# Altium project CamperPi.PrjPcb
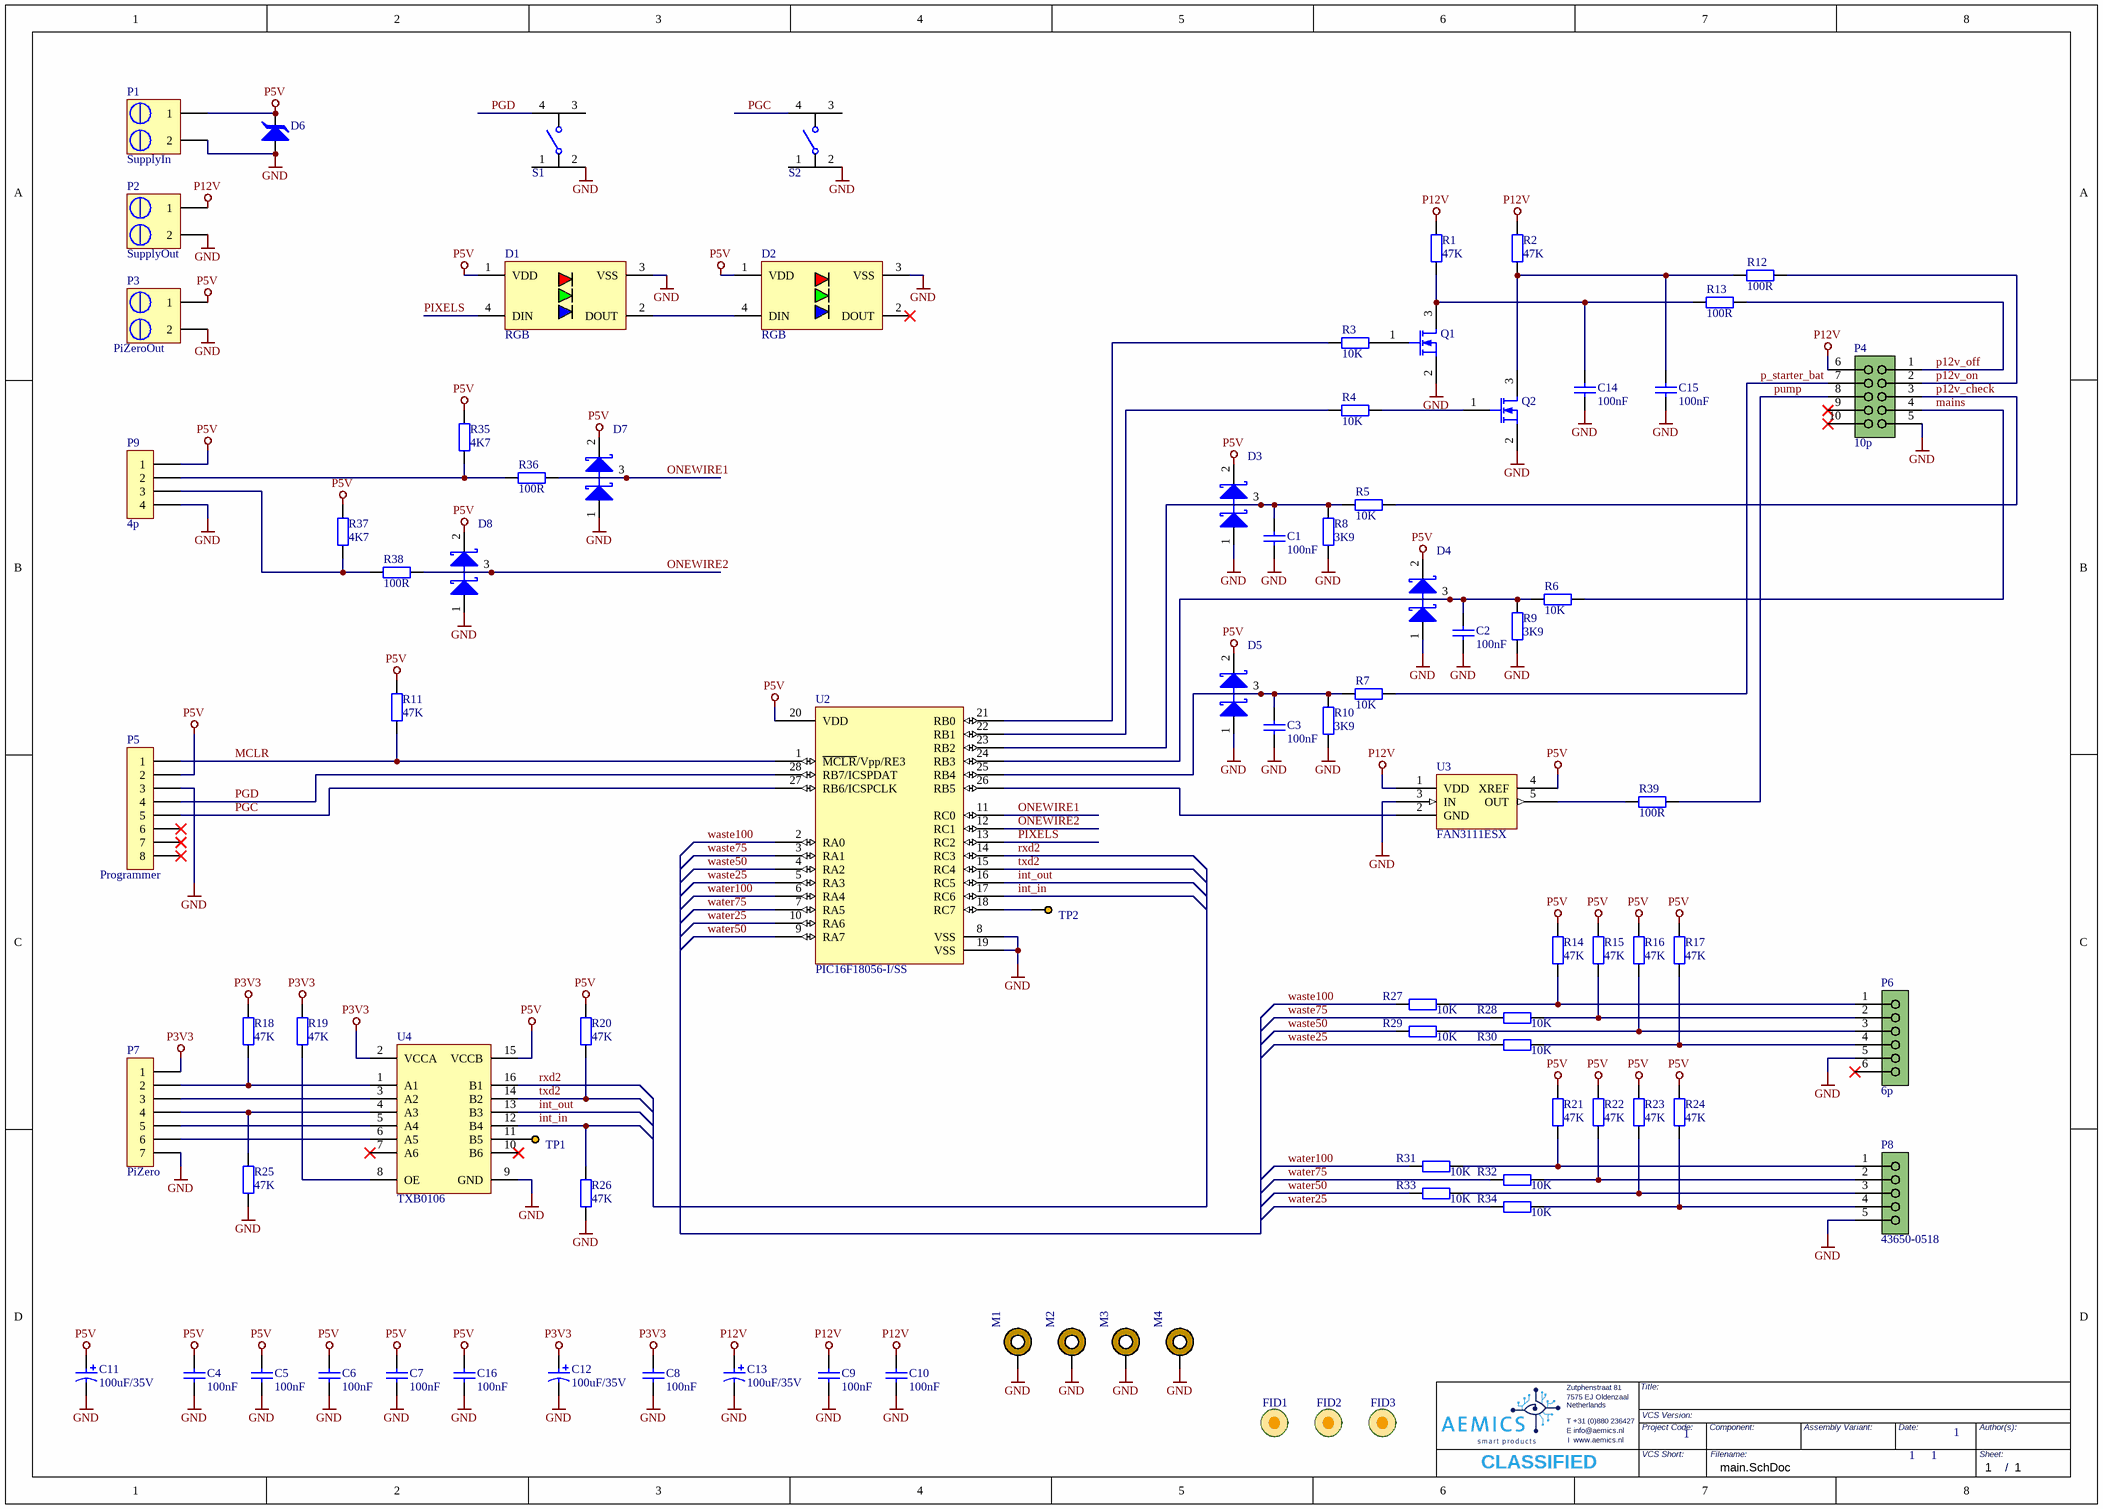
[diagram p0: main.SchDoc]
1 sheet, 88 parts. Net scope: global (net labels, ports and power ports of the same name join across sheets).
Board file: main.PcbDoc

## Sheet main.SchDoc: ?
size A3; ENG_APP_DATE: --/--/--; DSN_APP_DATE: --/--/--; CHK_APP_DATE: --/--/--; DrawnBy: ??; Organization: AEMICS; Address1: Zutphenstraat 81; Address2: 7575 EJ Oldenzaal; Address3: Netherlands; Address4: T +31 (0)880 236427; SheetNumber: 1; SheetTotal: 1; Clasification: CLASSIFIED; Project: ?????; Address6: E info@aemics.nl; Address7: I  www.aemics.nl

### Parts
C1  value 100nF  [C0603]  (hidden comment: Capacitor Ceramic)
C2  value 100nF  [C0603]  (hidden comment: Capacitor Ceramic)
C3  value 100nF  [C0603]  (hidden comment: Capacitor Ceramic)
C4  value 100nF  [C0603]  (hidden comment: Capacitor Ceramic)
C5  value 100nF  [C0603]  (hidden comment: Capacitor Ceramic)
C6  value 100nF  [C0603]  (hidden comment: Capacitor Ceramic)
C7  value 100nF  [C0603]  (hidden comment: Capacitor Ceramic)
C8  value 100nF  [C0603]  (hidden comment: Capacitor Ceramic)
C9  value 100nF  [C0603]  (hidden comment: Capacitor Ceramic)
C10  value 100nF  [C0603]  (hidden comment: Capacitor Ceramic)
C11  value 100uF/35V  [ELCO D-PACK]  (hidden comment: Capacitor Electrolytic)
C12  value 100uF/35V  [ELCO D-PACK]  (hidden comment: Capacitor Electrolytic)
C13  value 100uF/35V  [ELCO D-PACK]  (hidden comment: Capacitor Electrolytic)
C14  value 100nF  [C0603]  (hidden comment: Capacitor Ceramic)
C15  value 100nF  [C0603]  (hidden comment: Capacitor Ceramic)
C16  value 100nF  [C0603]  (hidden comment: Capacitor Ceramic)
D1  value RGB  [WS2812B-B]  (hidden comment: WS2812B-B)
D2  value RGB  [WS2812B-B]  (hidden comment: WS2812B-B)
D3  DIODE SCHOTTKY DUAL A1K2AK3  [SOT23-3]  (value not drawn)
D4  DIODE SCHOTTKY DUAL A1K2AK3  [SOT23-3]  (value not drawn)
D5  DIODE SCHOTTKY DUAL A1K2AK3  [SOT23-3]  (value not drawn)
D6  DIODE TVS UNIDIR A1K2  [SOD-323]  (value not drawn)
D7  DIODE SCHOTTKY DUAL A1K2AK3  [SOT23-3]  (value not drawn)
D8  DIODE SCHOTTKY DUAL A1K2AK3  [SOT23-3]  (value not drawn)
FID1  Fiducial  [FIDUCIAL1MM]  (value not drawn)
FID2  Fiducial  [FIDUCIAL1MM]  (value not drawn)
FID3  Fiducial  [FIDUCIAL1MM]  (value not drawn)
M1  PTH  [PTH-M2.5-D4.0]  (value not drawn)
M2  PTH  [PTH-M2.5-D4.0]  (value not drawn)
M3  PTH  [PTH-M2.5-D4.0]  (value not drawn)
M4  PTH  [PTH-M2.5-D4.0]  (value not drawn)
P1  value SupplyIn  [TERMBLOCK508P-SCREW-2]  (hidden comment: ScrewTerminal 2p)
P2  value SupplyOut  [TERMBLOCK508P-SCREW-2]  (hidden comment: ScrewTerminal 2p)
P3  value PiZeroOut  [TERMBLOCK508P-SCREW-2]  (hidden comment: ScrewTerminal 2p)
P4  value 10p  [MOLEX 43045-1012]  (hidden comment: SOCKET2X005)
P5  value Programmer  [TSW-108-07-F-S]  (hidden comment: HDR8x1)
P6  value 6p  [MOLEX 43650-0618]  (hidden comment: SOCKET1X006)
P7  value PiZero  [HDR1X7-P254]  (hidden comment: HDR7x1)
P8  value 43650-0518  [MOLEX 43650-0518]  (hidden comment: SOCKET1X005)
P9  value 4p  [TSW-104-06-G-S]  (hidden comment: HDR4x1)
Q1  MOSFET N GSD  [SOT23-3]  (value not drawn)
Q2  MOSFET N GSD  [SOT23-3]  (value not drawn)
R1  value 47K  [R0603]  (hidden comment: Resistor)
R2  value 47K  [R0603]  (hidden comment: Resistor)
R3  value 10K  [R0603]  (hidden comment: Resistor)
R4  value 10K  [R0603]  (hidden comment: Resistor)
R5  value 10K  [R0603]  (hidden comment: Resistor)
R6  value 10K  [R0603]  (hidden comment: Resistor)
R7  value 10K  [R0603]  (hidden comment: Resistor)
R8  value 3K9  [R0603]  (hidden comment: Resistor)
R9  value 3K9  [R0603]  (hidden comment: Resistor)
R10  value 3K9  [R0603]  (hidden comment: Resistor)
R11  value 47K  [R0603]  (hidden comment: Resistor)
R12  value 100R  [R0603]  (hidden comment: Resistor)
R13  value 100R  [R0603]  (hidden comment: Resistor)
R14  value 47K  [R0603]  (hidden comment: Resistor)
R15  value 47K  [R0603]  (hidden comment: Resistor)
R16  value 47K  [R0603]  (hidden comment: Resistor)
R17  value 47K  [R0603]  (hidden comment: Resistor)
R18  value 47K  [R0603]  (hidden comment: Resistor)
R19  value 47K  [R0603]  (hidden comment: Resistor)
R20  value 47K  [R0603]  (hidden comment: Resistor)
R21  value 47K  [R0603]  (hidden comment: Resistor)
R22  value 47K  [R0603]  (hidden comment: Resistor)
R23  value 47K  [R0603]  (hidden comment: Resistor)
R24  value 47K  [R0603]  (hidden comment: Resistor)
R25  value 47K  [R0603]  (hidden comment: Resistor)
R26  value 47K  [R0603]  (hidden comment: Resistor)
R27  value 10K  [R0603]  (hidden comment: Resistor)
R28  value 10K  [R0603]  (hidden comment: Resistor)
R29  value 10K  [R0603]  (hidden comment: Resistor)
R30  value 10K  [R0603]  (hidden comment: Resistor)
R31  value 10K  [R0603]  (hidden comment: Resistor)
R32  value 10K  [R0603]  (hidden comment: Resistor)
R33  value 10K  [R0603]  (hidden comment: Resistor)
R34  value 10K  [R0603]  (hidden comment: Resistor)
R35  value 4K7  [R0603]  (hidden comment: Resistor)
R36  value 100R  [R0603]  (hidden comment: Resistor)
R37  value 4K7  [R0603]  (hidden comment: Resistor)
R38  value 100R  [R0603]  (hidden comment: Resistor)
R39  value 100R  [R0603]  (hidden comment: Resistor)
S1  WE-TATV  [WE-TATV]  (value not drawn)
S2  WE-TATV  [WE-TATV]  (value not drawn)
TP1  Testpoint  [TESTPAD_R2]  (value not drawn)  (no BOM)
TP2  Testpoint  [TESTPAD_R2]  (value not drawn)  (no BOM)
U2  value PIC16F18056-I/SS  [TSOP065P07.80X10.20X02.00-28]  (hidden comment: PIC16F18056-ISS)
U3  value FAN3111ESX  [SOT23-5]  (hidden comment: FAN3111E)
U4  TXB0106  [TSOP065P05.00X06.40X01.20-16]

### Nets
GND: C1.2 C2.2 C3.2 C4.2 C5.2 C6.2 C7.2 C8.2 C9.2 C10.2 C11.2 C12.2 C13.2 C14.2 C15.2 C16.2 D1.3(VSS) D2.3(VSS) D3.1(A) D4.1(A) D5.1(A) D6.1(A) D7.1(A) D8.1(A) M1.1 M2.1 M3.1 M4.1 P1.2 P2.2 P3.2 P4.5 P5.3 P6.5 P7.7 P8.5 P9.4 Q1.2(S) Q2.2(S) R8.2 R9.2 R10.2 R25.2 R26.2 S1.2(COMMON1) S2.2(COMMON1) U2.8(VSS) U2.19(VSS) U3.3(IN) U4.9(GND)
P3V3: C8.1 C12.1 P7.1 R18.1 R19.1 U4.2(VCCA)
P5V: C4.1 C5.1 C6.1 C7.1 C11.1 C16.1 D1.1(VDD) D2.1(VDD) D3.2(K) D4.2(K) D5.2(K) D6.2(K) D7.2(K) D8.2(K) P1.1 P3.1 P5.2 P9.1 R11.1 R14.1 R15.1 R16.1 R17.1 R20.1 R21.1 R22.1 R23.1 R24.1 R35.1 R37.1 U2.20(VDD) U3.4(XREF) U4.15(VCCB)
P12V: C9.1 C10.1 C13.1 P2.1 P4.6 R1.1 R2.1 U3.1(VDD)
int_in: R26.1 U2.17(RC6) U4.12(B4)
int_out: U2.16(RC5) U4.13(B3)
mains: P4.4 R6.2
MCLR: P5.1 R11.2 U2.1(~{MCLR}/Vpp/RE3)
ONEWIRE1: D7.3 R36.1 U2.11(RC0)
ONEWIRE2: D8.3 R38.1 U2.12(RC1)
p12v_check: P4.3 R5.2
p12v_off: P4.1 R13.1
p12v_on: P4.2 R12.1
p_starter_bat: P4.7 R7.2
PGC: P5.5 S2.4(NO) U2.27(RB6/ICSPCLK)
PGD: P5.4 S1.4(NO) U2.28(RB7/ICSPDAT)
PIXELS: D1.4(DIN) U2.13(RC2)
pump: P4.8 R39.1
rxd2: U2.14(RC3) U4.16(B1)
txd2: R20.2 U2.15(RC4) U4.14(B2)
waste25: R30.1 U2.5(RA3)
waste50: R29.1 U2.4(RA2)
waste75: R28.1 U2.3(RA1)
waste100: R27.1 U2.2(RA0)
water25: R34.1 U2.10(RA6)
water50: R33.1 U2.9(RA7)
water75: R32.1 U2.7(RA5)
water100: R31.1 U2.6(RA4)
NetC1_1: C1.1 D3.3 R5.1 R8.1 U2.23(RB2)
NetC2_1: C2.1 D4.3 R6.1 R9.1 U2.24(RB3)
NetC3_1: C3.1 D5.3 R7.1 R10.1 U2.25(RB4)
NetC14_1: C14.1 Q1.3(D) R1.2 R13.2
NetC15_1: C15.1 Q2.3(D) R2.2 R12.2
NetD1_2: D1.2(DOUT) D2.4(DIN)
NetP6_1: P6.1 R14.2 R27.2
NetP6_2: P6.2 R15.2 R28.2
NetP6_3: P6.3 R16.2 R29.2
NetP6_4: P6.4 R17.2 R30.2
NetP7_2: P7.2 R18.2 U4.1(A1)
NetP7_3: P7.3 U4.3(A2)
NetP7_4: P7.4 R25.1 U4.4(A3)
NetP7_5: P7.5 U4.5(A4)
NetP7_6: P7.6 U4.6(A5)
NetP8_1: P8.1 R21.2 R31.2
NetP8_2: P8.2 R22.2 R32.2
NetP8_3: P8.3 R23.2 R33.2
NetP8_4: P8.4 R24.2 R34.2
NetP9_2: P9.2 R35.2 R36.2
NetP9_3: P9.3 R37.2 R38.2
NetQ1_1: Q1.1(G) R3.2
NetQ2_1: Q2.1(G) R4.2
NetR3_1: R3.1 U2.21(RB0)
NetR4_1: R4.1 U2.22(RB1)
NetR19_2: R19.2 U4.8(OE)
NetR39_2: R39.2 U3.5(OUT)
NetTP1_1: TP1.1(pin_1) U4.11(B5)
NetTP2_1: TP2.1(pin_1) U2.18(RC7)
NetU2_26: U2.26(RB5) U3.2(GND)

Not connected (* = marked no-connect by the designer): D2 2(DOUT)*; P4 9* 10*; P5 6* 7* 8*; P6 6*; S1 1(NC) 3(NO); S2 1(NC) 3(NO); U4 7(A6)* 10(B6)*

### Notes on the sheet
- 1
- Zutphenstraat 81
- 7575 EJ Oldenzaal
- Title:
- T +31 (0)880 236427
- Netherlands
- E info@aemics.nl
- I  www.aemics.nl
- Project Code:
- VCS Version:
- VCS Short:
- Component:
- Filename:
- Assembly Variant:
- Date:
- Sheet:
- Author(s):
- /

### Library data of the parts
C1-C10 C14-C16 = 45000079: CAP, CER, 0603, 100nF, 50V, X7R,±10%; Manufacturer 1: KEMET; Manufacturer 1 P/N: C0603X104K5RACTU; Manufacturer 2 P/N: 885012206095; Manufacturer 3 P/N: CC0603KRX7R9BB104; Manufacturer P/N Count: 16; Unit Type: pcs; Umbrella P/N: C0603/100nF/50V/X7R; id: 45000079; Component Type: Capacitor, Ceramic; Manufacturer 2: Wurth Elektronik; Manufacturer 3: Yageo
C11-C13 = 45000014: CAP, ELC, 6.3x5.8, 100uF, 35V, 20%; Manufacturer 1: Panasonic; Manufacturer 1 P/N: EEE-FT1V101AP; Manufacturer 2 P/N: EEEFT1V101AP; Manufacturer P/N Count: 2; Unit Type: pcs; id: 45000014; Component Type: Capacitor, Electrolytic; Manufacturer 2: Panasonic
D1 D2 = 45006194: LED,Adressable,RGB; Manufacturer 1: Worldsemi; Unit Quantity: 1; Unit Type: pcs; id: 45006194; Component Type: Diode, LED; Manufacturer 1 P/N: WS2812B-B; Manufacturer P/N Count: 1
D3-D5 D7 D8 = 45000071: Schottky Barrier Diode, Dual, Series; Manufacturer 1: NXP Semiconductors; Manufacturer 1 P/N: BAT54S; Manufacturer P/N Count: 1; Unit Type: pcs; id: 45000071; Component Type: Diode, Schottky
D6 = 45002477: TVS Diode, Unidirectional, 5V, 300mW; Manufacturer 1: ON Semiconductor; Manufacturer 1 P/N: SD05T1G; Manufacturer P/N Count: 1; id: 45002477; Component Type: Diode, TVS
FID1-FID3 = 45000048: Fiducial Mark,Round,1mm; Manufacturer 1: mechanical; Manufacturer P/N Count: 1; Unit Type: pcs; id: 45000048; Component Type: Mechanical, Fiducials / Net-Ties / Markers; Manufacturer 1 P/N: mechanical
M1-M4 = 45000530: Plated Through-Hole, M2.5; Manufacturer 1: mechanical; Manufacturer P/N Count: 1; Unit Type: pcs; id: 45000530; Component Type: Mechanical, Single SMD & THT Pads / Testpoints; Manufacturer 1 P/N: mechanical
P1-P3 = 45001155: Terminal Block, 5.08mm Pitch, Screw Contacts; Manufacturer 1: PHOENIX CONTACT; Manufacturer 1 P/N: 1715721; Manufacturer 2 P/N: MC24366; Manufacturer P/N Count: 2; Unit Type: pcs; id: 45001155; Component Type: Connector, Terminal Block; Manufacturer 2: Multicomp
P4 = 45007936: Socket, Vertical, 2x5p,3mm; Manufacturer 1: MOLEX; Manufacturer 1 P/N: 43045-1012; Manufacturer 2 P/N: 0430451012; Manufacturer P/N Count: 2; Unit Quantity: 1; Unit Type: pcs; id: 45007936; Component Type: Connector, Header; Manufacturer 2: Molex
P5 = 45000411: Samtec TSW Header,2.54mm Pitch,Single Row,Vertical; Manufacturer P/N Count: 1; id: 45000411; Component Type: Connector, Header; Manufacturer 1: Samtec; Manufacturer 1 P/N: TSW-108-07-F-S
P6 = 45007935: Socket, Vertical, 6p, 3mm; Manufacturer 1: Molex; Manufacturer 1 P/N: 43650-0618; Manufacturer 2 P/N: 0436500618; Manufacturer P/N Count: 2; Unit Quantity: 1; Unit Type: pcs; id: 45007935; Component Type: Connector, Header; Manufacturer 2: Molex
P7 = 45000355: Samtec TSW Header,2.54mm Pitch,Single Row,Vertical; Manufacturer 1 P/N: TSW-107-07-F-S; Manufacturer P/N Count: 1; Unit Type: pcs; id: 45000355; Component Type: Connector, Header; Manufacturer 1: Samtec
P8 = 45007934: Socket, Vertical, 5p, 3mm; Manufacturer 1: Molex; Manufacturer 2 P/N: 0436500518; Manufacturer P/N Count: 2; Unit Quantity: 1; Unit Type: pcs; id: 45007934; Component Type: Connector, Header; Manufacturer 1 P/N: 43650-0518; Manufacturer 2: Molex
P9 = 45003711: Samtec TSW Header,Single Row,Vertical,5.21mm Height,Gold Flash; Manufacturer P/N Count: 1; id: 45003711; Component Type: Connector, Header; Manufacturer 1: Samtec; Manufacturer 1 P/N: TSW-104-06-G-S
Q1 Q2 = 45003086: MOSFET, N Channel, 310 mA, 60 V, 0.86 ohm; Manufacturer 1: ON Semiconductor; Manufacturer 1 P/N: 2N7002ET1G; Manufacturer P/N Count: 1; Unit Type: pcs; id: 45003086; Component Type: MOSFET, N-Channel
R1 R2 R11 R14-R26 = 45000492: RES, 0603, 47K, 1%,100mW; Manufacturer 1: MULTICOMP PRO; Manufacturer 1 P/N: MCWR06X4702FTL; Manufacturer 2 P/N: CRCW060347K0FKEA.; Manufacturer 3 P/N: MC0603SAF4702T5E; Manufacturer P/N Count: 4; Unit Type: pcs; Umbrella P/N: R0603/47K/0.1W/1%; id: 45000492; Component Type: Resistor, Thick Film; Manufacturer 2: VISHAY; Manufacturer 3: MULTICOMP PRO
R3-R7 R27-R34 = 45000125: RES, 0603, 10K,63mW,1%; Manufacturer 1: RS PRO; Manufacturer 1 P/N: 804-8921; Manufacturer 2 P/N: WR06X1002FTL; Manufacturer 3 P/N: CR0603-FX-1002ELF; Manufacturer P/N Count: 4; Unit Type: pcs; Umbrella P/N: R0603/10K/63mW/1%; id: 45000125; Component Type: Resistor, Thick Film; Manufacturer 2: WALSIN; Manufacturer 3: BOURNS
R8-R10 = 45000333: RES, 0603, 3K9, 0.063W, 1%; Manufacturer P/N Count: 0; Umbrella P/N: R0603/3K9/0.063W/1%; id: 45000333; Component Type: Resistor, Thick Film
R12 R13 R36 R38 R39 = 45000124: RES, 0603, 100R, 0.063W, 1%; Manufacturer 1: WALSIN; Manufacturer 1 P/N: WR06X1000FTL; Manufacturer 2 P/N: MCWR06X1000FTL; Manufacturer 3 P/N: ERJ3EKF1000V; Manufacturer P/N Count: 9; Unit Type: pcs; Umbrella P/N: R0603/100R/0.063W/1%; id: 45000124; Component Type: Resistor, Thick Film; Manufacturer 2: MULTICOMP PRO; Manufacturer 3: PANASONIC
R35 R37 = 45000145: RES, 0603, 4K7, 0.063W, 1%; Manufacturer 1: VISHAY; Manufacturer 1 P/N: CRCW06034K70FKEA.; Manufacturer 2 P/N: ERJ3EKF4701V; Manufacturer 3 P/N: MCMR06X4701FTL; Manufacturer P/N Count: 6; Unit Type: pcs; Umbrella P/N: R0603/4K7/0.063W/1%; id: 45000145; Component Type: Resistor, Thick Film; Manufacturer 2: PANASONIC; Manufacturer 3: MULTICOMP PRO
S1 S2 = 45001114: WE TATV Series Tactile Switch, TH, 12x12mm, Square Actuator, Black; Manufacturer 1: WURTH ELEKTRONIK; Manufacturer 1 P/N: 430476073716; Manufacturer 2 P/N: 430 476 073 716; Manufacturer P/N Count: 2; Unit Type: pcs; id: 45001114; Component Type: Switches & Buttons, Button; Manufacturer 2: Würth Elektronik
TP1 TP2 = 45001579: Test Point for PCB, Round,2mm; Manufacturer 1: mechanical; Manufacturer P/N Count: 1; Unit Type: pcs; id: 45001579; Component Type: Mechanical, Single SMD & THT Pads / Testpoints; Manufacturer 1 P/N: mechanical
U2 = 45007932: MCU, 8BIT, 28KB FLASH, 28SSOP; Manufacturer 1: Microchip; Unit Quantity: 1; Unit Type: pcs; id: 45007932; Component Type: IC, Microcontrollers; Manufacturer 1 P/N: PIC16F18056-I/SS; Manufacturer P/N Count: 1
U3 = 45007933: Low-Side,Gate Driver,Non-Inverting,SOT-23-5; Manufacturer 1: onsemi; Unit Quantity: 1; Unit Type: pcs; id: 45007933; Component Type: IC, Controllers / Drivers / Transceivers; Manufacturer 1 P/N: FAN3111ESX; Manufacturer P/N Count: 1
U4 = 45002309: 6-Bit Bidirectional Level-Shifting and Voltage Translator With Auto-Direction Sensing; Manufacturer 1: Texas Instruments; Manufacturer 1 P/N: TXB0106PWR; Unit Quantity: 1; id: 45002309; Value: TXB0106; Component Type: IC, Controllers / Drivers / Transceivers; Manufacturer P/N Count: 1